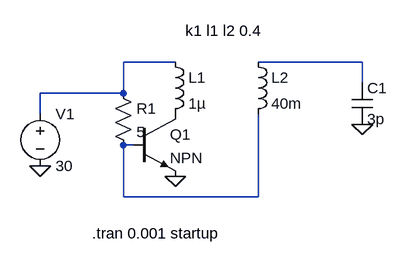
[diagram p0: schematic SlayerrExciterStartupSimulation.asc]
SlayerrExciterStartupSimulation.asc, the LTspice schematic file:
Version 4.1
SHEET 1 880 680
WIRE 160 -48 80 -48
WIRE 448 -48 288 -48
WIRE 448 -16 448 -48
WIRE 80 0 80 -48
WIRE 80 0 -48 0
WIRE -48 32 -48 0
WIRE 96 80 80 80
WIRE 80 160 80 80
WIRE 288 160 288 32
WIRE 288 160 80 160
FLAG 448 48 0
FLAG 160 128 0
FLAG -48 112 0
SYMBOL ind 144 -64 R0
SYMATTR InstName L1
SYMATTR Value 1µ
SYMATTR Type ind
SYMBOL ind 272 -64 R0
SYMATTR InstName L2
SYMATTR Value 40m
SYMATTR Type ind
SYMBOL cap 432 -16 R0
SYMATTR InstName C1
SYMATTR Value 3p
SYMBOL res 64 -16 R0
SYMATTR InstName R1
SYMATTR Value 5
SYMBOL voltage -48 16 R0
WINDOW 123 0 0 Left 0
WINDOW 39 0 0 Left 0
SYMATTR InstName V1
SYMATTR Value 30
SYMBOL npn 96 32 R0
SYMATTR InstName Q1
TEXT 32 216 Left 2 !.tran 0.001 startup
TEXT 176 -96 Left 2 !k1 l1 l2 0.4

The netlist it stands for:
* SlayerrExciterStartupSimulation.asc
L1 N001 P001 1µ
L2 N002 N003 40m
C1 N002 0 3p
R1 N001 N003 5
V1 N001 0 30
Q1 P001 N003 0 0 NPN
.model NPN NPN
.model PNP PNP
.lib standard.bjt
.tran 0.001 startup
k1 l1 l2 0.4
.backanno
.end